# EAGLE design MAM_GND (EAGLE 9.4.2)
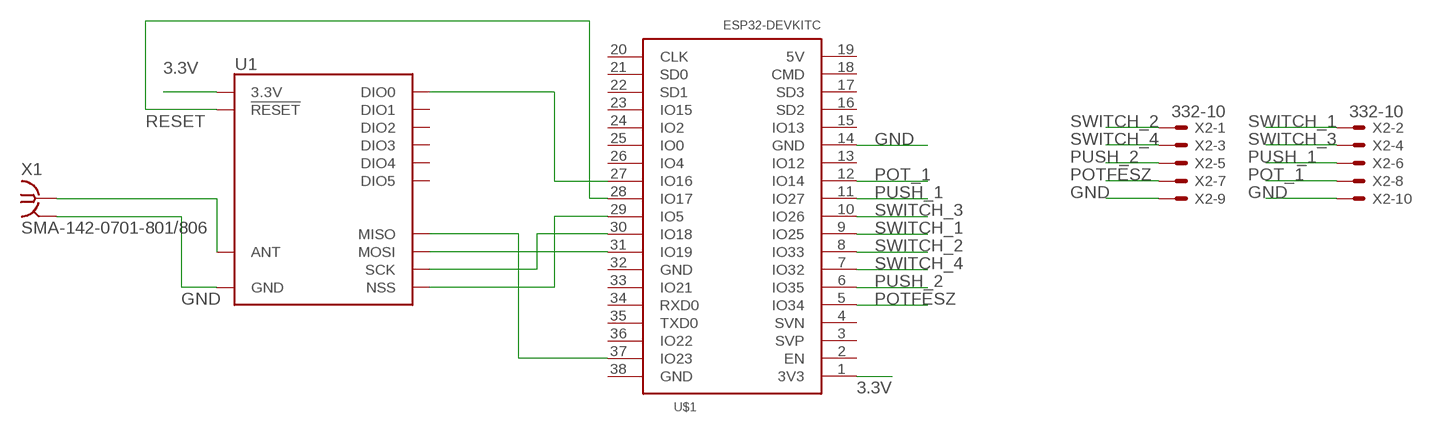
[diagram p0: schematic, sheet 1]

## Parts
U1  RFM95W  [RFM95/96/97/98W]
U$1  ESP32DEVKITC  [ESP32-DEVKITC]
X1  SMA-142-0701-801/806  [J502-ND-142-0701-801/806]
X2  332-10  [332-10]

## Nets
3.3V: U1.3.3V U$1.1(3V3)
GND: U1.GND@1(GND) U1.GND@2(GND) U1.GND@3(GND) U$1.14(GND) X1.G@1 X1.G@2 X1.G@3 X1.G@4 X2.9 X2.10
N$1: U1.MISO U$1.37(IO23)
N$2: U1.MOSI U$1.31(IO19)
N$3: U1.SCK U$1.30(IO18)
N$4: U1.NSS U$1.29(IO5)
N$5: U1.DIO0 U$1.27(IO16)
N$6: U1.ANT X1.1
POT_1: U$1.12(IO14) X2.8
POTFESZ: U$1.5(IO34) X2.7
PUSH_1: U$1.11(IO27) X2.6
PUSH_2: U$1.6(IO35) X2.5
RESET: U1.!RESET U$1.28(IO17)
SWITCH_1: U$1.9(IO25) X2.2
SWITCH_2: U$1.8(IO33) X2.1
SWITCH_3: U$1.10(IO26) X2.4
SWITCH_4: U$1.7(IO32) X2.3
Unconnected: U1.DIO1 U1.DIO2 U1.DIO3 U1.DIO4 U1.DIO5 U$1.2(EN) U$1.3(SVP) U$1.4(SVN) U$1.13(IO12) U$1.15(IO13) U$1.16(SD2) U$1.17(SD3) U$1.18(CMD) U$1.19(5V) U$1.20(CLK) U$1.21(SD0) U$1.22(SD1) U$1.23(IO15) U$1.24(IO2) U$1.25(IO0) U$1.26(IO4) U$1.32(GND) U$1.33(IO21) U$1.34(RXD0) U$1.35(TXD0) U$1.36(IO22) U$1.38(GND)

## Library data of the parts
U1 = SparkFun-RF:RFM95W: RFM95/96/97/98 The RFM95/96/97/98(W) transceivers feature the LoRaTM long range modem that provides ultra-long range spread spectrum communication and high interference immunity whilst minimising current consumption. These devices also support high performance (G)FSK modes for systems including WMBus, IEEE802.15.4g. The RFM95/96/97/98(W) deliver exceptional phase noise, selectivity, receiver linearity and IIP3 for significantly lower current consumption than competing devices Datasheet <http://www.hoperf.com/upload/rf/RFM95_96_97_98W.pdf>; PROD_ID: IC-13959
U$1 = ESP32-DEVKITC:ESP32DEVKITC
X1 = con-coax:SMA-: SMA 50 Ohm End Launch Jack Receptacle - Round Contact Johnson Components Source: www.johnsoncomponents.com .. J502-ND.pdf; MF: JOHNSON COMPONENTS; MPN: 142-0701-801; OC_FARNELL: 1608592; OC_NEWARK: 90F2624
X2 = con-garry:332-10: 10 Pin - 2mm Dual Row Source: www.mpe-connector.de / garry_shortform_2012.pdf

## Board
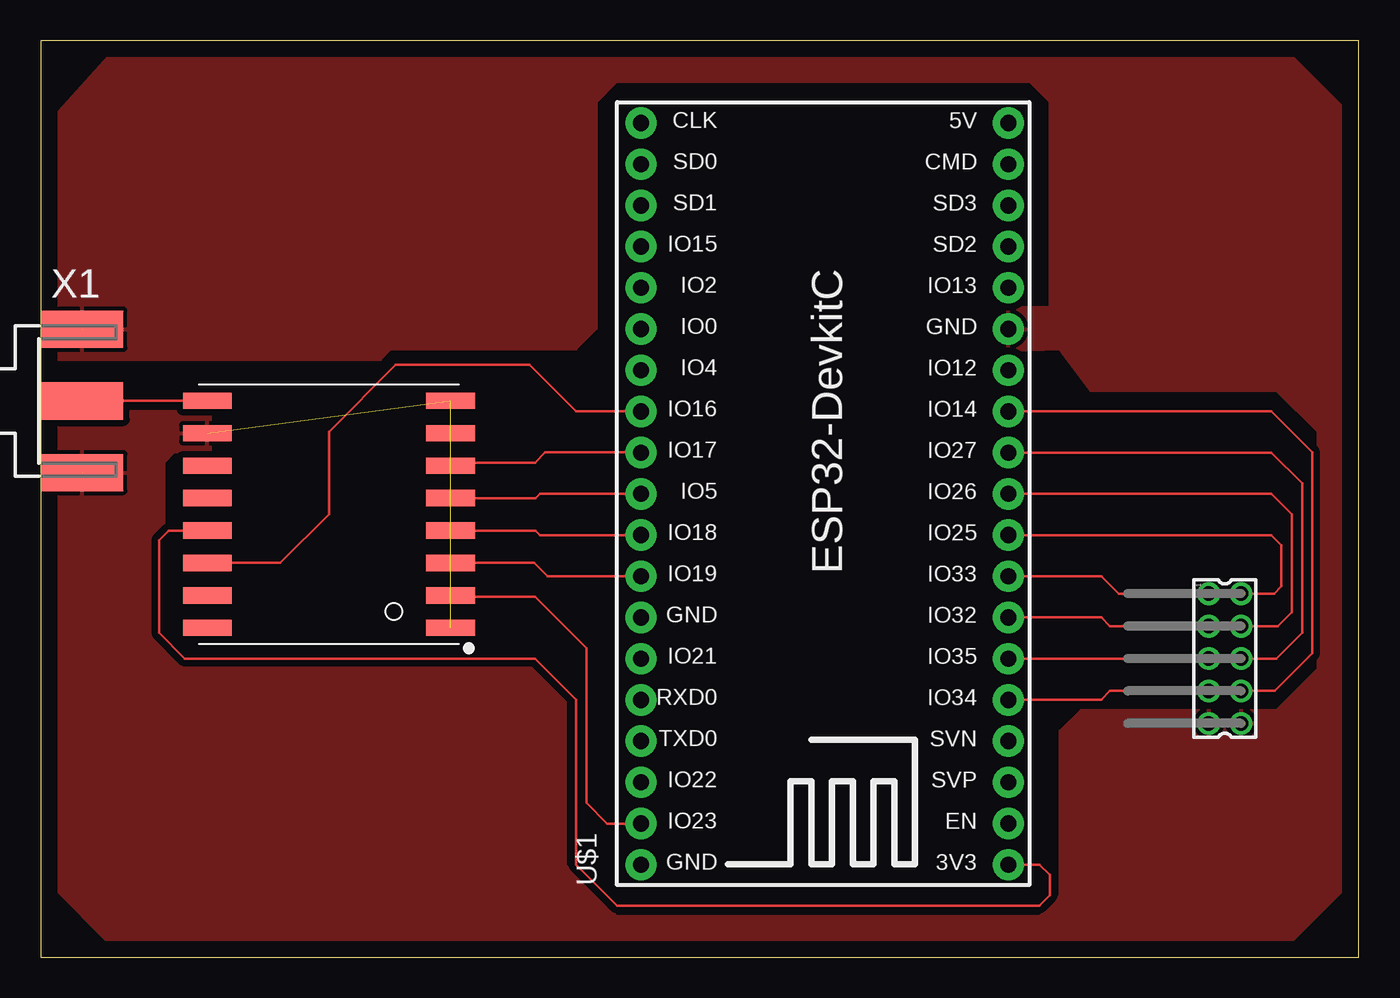
[diagram p1: board, top side]
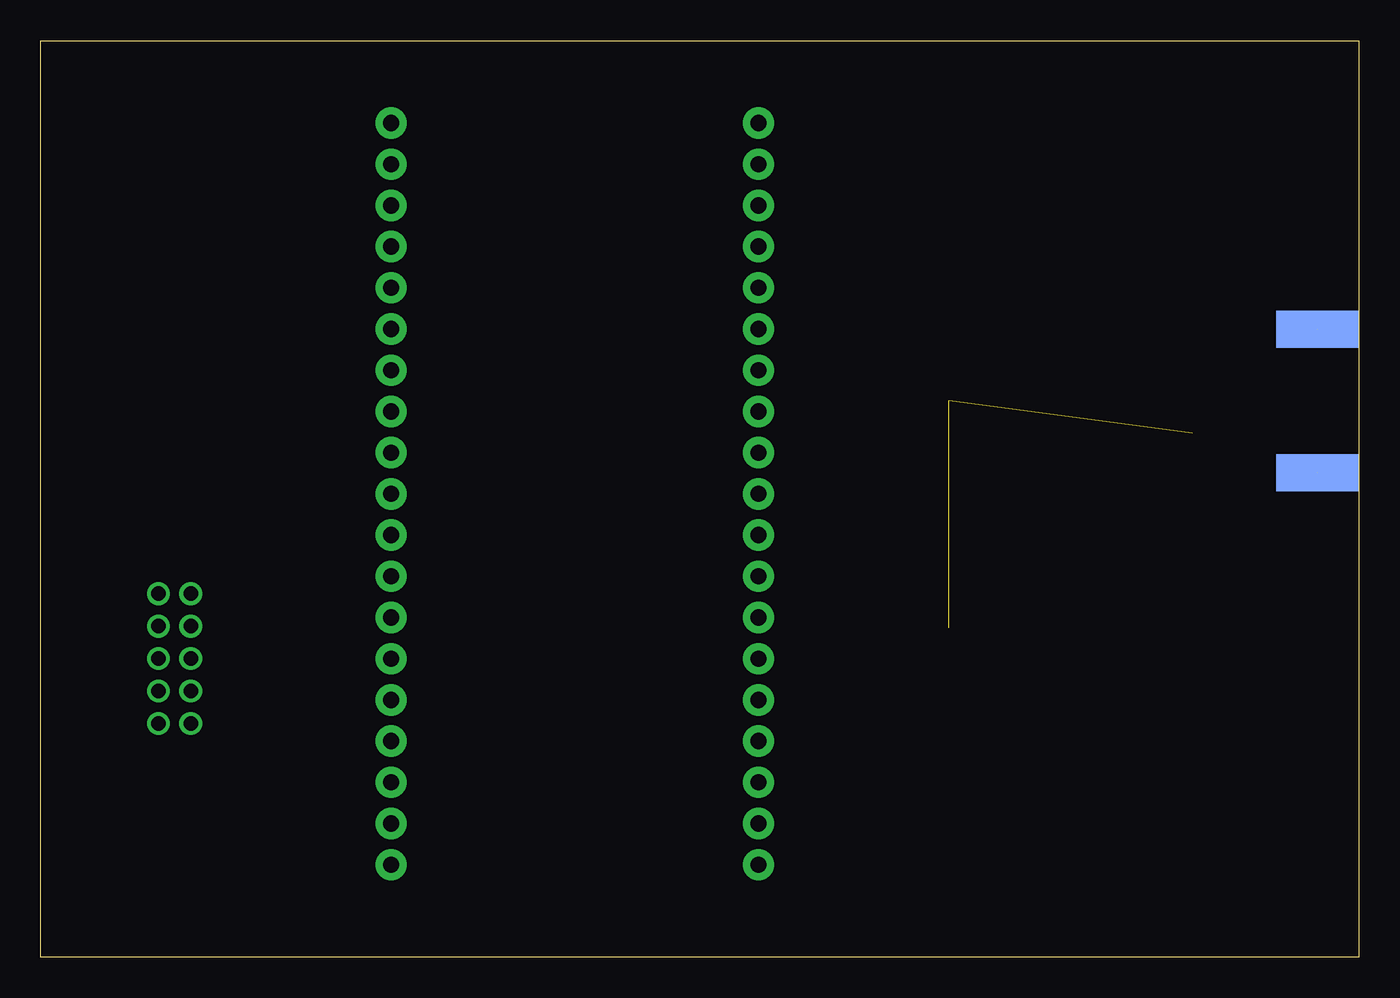
[diagram p2: board, bottom side, seen from below]

Size 81.29 x 56.51 mm. Coordinates in mm from the lower left corner, seen from the top.
Outline: 0,0 81.29,0 81.27,56.51 0,56.51 0,0
Copper layers (1*16): Top 0.035mm / dielectric 1.5mm / Bottom 0.035mm
Design rules "default": minimum track width 6mil, minimum drill 0.35mm, track to track 6mil, track to pad 6mil, pad to pad 6mil, via to via 6mil, smd to smd 6mil, copper to edge 40mil, drill to drill 6mil, minimum pad ring 10mil, minimum via ring 8mil, stop-mask expansion 4mil, vias tented up to drill 0mil, thermal gap 10mil

### Footprints (pad centres in the part's own frame; a part is rotated, then mirrored left to right if it is on the bottom)
RFM95/96/97/98W = smd 3 x 1: 3.3V 7.5,1; !RESET -7.5,-3; ANT 7.5,-7; DIO0 7.5,3; DIO1 7.5,5; DIO2 7.5,7; DIO3 7.5,-3; DIO4 7.5,-1; DIO5 -7.5,-5; GND@1 -7.5,7; GND@2 -7.5,-7; GND@3 7.5,-5; MISO -7.5,5; MOSI -7.5,3; NSS -7.5,-1; SCK -7.5,1
ESP32-DEVKITC = drill 1 pad 1.93: 1 -22.87,-11.42; 2 -20.33,-11.42; 3 -17.79,-11.42; 4 -15.25,-11.42; 5 -12.71,-11.42; 6 -10.17,-11.42; 7 -7.63,-11.42; 8 -5.09,-11.42; 9 -2.55,-11.42; 10 -0.01,-11.42; 11 2.53,-11.42; 12 5.07,-11.42; 13 7.61,-11.42; 14 10.15,-11.42; 15 12.69,-11.42; 16 15.23,-11.42; 17 17.77,-11.42; 18 20.31,-11.42; 19 22.85,-11.42; 20 22.85,11.23; 21 20.31,11.23; 22 17.77,11.23; 23 15.23,11.23; 24 12.69,11.23; 25 10.15,11.23; 26 7.61,11.23; 27 5.07,11.23; 28 2.53,11.23; 29 -0.01,11.23; 30 -2.55,11.23; 31 -5.09,11.23; 32 -7.63,11.23; 33 -10.17,11.23; 34 -12.71,11.23; 35 -15.25,11.23; 36 -17.79,11.23; 37 -20.33,11.23; 38 -22.87,11.23
J502-ND-142-0701-801/806 = smd 5.08 x 2.286: 1 2.565,0; G@1 2.565,4.42; G@2 2.565,-4.42 | smd 5.08 x 2.286 bottom: G@3 2.565,4.42; G@4 2.565,-4.42
332-10 = drill 0.9 pad 1.27: 1 -4,-1; 2 -4,1; 3 -2,-1; 4 -2,1; 5 0,-1; 6 0,1; 7 2,-1; 8 2,1; 9 4,-1; 10 4,1

### Placement (x,y rotation side)
U1  17.78,27.3 180 top
U$1  48.26,28.57 90 top
X1  0,34.29 0 top
X2  73.03,18.41 270 top

### Tracks (layer width: path | path; a pad name or v marks a point on that pad's centre or on a via)
3.3V
  Top 0.152: U1.3.3V 7.89,26.3 7.3,25.72 7.3,20 8.89,18.41 30.48,18.41 33.02,15.88 33.02,5.71 35.56,3.17 61.59,3.17 62.23,3.81 62.23,5.08 61.59,5.71 59.69,5.71 U$1.1
GND  (4 unrouted)
  pour Top (isolate 0.406): 0,5.08 0,33.02 0.64,33.66 10.48,33.66 10.48,31.11 8.26,31.11 7.62,30.48 7.62,20.32 8.89,19.05 30.48,19.05 32.38,17.14 32.38,5.71 35.56,2.54 61.59,2.54 62.87,3.81 62.87,13.97 64.14,15.24 76.2,15.24 78.74,17.78 78.74,32.38 76.2,34.93 64.77,34.93 62.87,37.47 58.99,37.35 58.99,40.07 62.23,40.07 62.23,52.71 60.96,53.98 35.56,53.98 34.29,52.71 34.29,38.74 33.02,37.47 21.59,37.47 20.95,36.83 0,36.83 -0.03,50.89 5.08,56.52 76.2,56.52 81.28,51.44 81.28,5.08 76.2,0 5.08,0
N$1
  Top 0.152: U1.MISO 25.36,22.22 30.48,22.22 33.66,19.05 33.66,9.53 34.94,8.24 U$1.37
N$2
  Top 0.152: U1.MOSI 30.43,24.3 31.25,23.48 U$1.31
N$3
  Top 0.152: U1.SCK 30.53,26.3 30.81,26.02 U$1.30
N$4
  Top 0.152: U$1.29 37.02,28.57 30.8,28.57 30.53,28.3 U1.NSS
N$5
  Top 0.152: 10.6,24.62 U1.DIO0 14.78,24.3 17.78,27.3 17.78,32.38 21.91,36.51 30.16,36.51 33.03,33.65 U$1.27
N$6
  Top 0.152: X1.1 10.27,34.29 U1.ANT
POT_1
  Top 0.152: U$1.12 75.89,33.65 78.42,31.11 78.42,18.73 76.11,16.41 X2.8
POTFESZ
  Top 0.152: U$1.5 65.39,15.87 65.94,16.41 X2.7
PUSH_1
  Top 0.152: U$1.11 75.89,31.11 77.79,29.21 77.79,20 76.2,18.41 X2.6
PUSH_2
  Top 0.152: U$1.6 72.02,18.41 X2.5
RESET
  Top 0.152: U$1.28 31.11,31.11 30.48,30.48 25.45,30.48 U1.!RESET
SWITCH_1
  Top 0.152: X2.2 76.07,22.41 76.52,22.86 76.52,25.4 75.89,26.02 U$1.9
SWITCH_2
  Top 0.152: U$1.8 65.42,23.48 66.48,22.41 X2.1
SWITCH_3
  Top 0.152: X2.4 76.3,20.41 77.15,21.27 77.15,27.3 75.88,28.57 59.69,28.57 U$1.10
SWITCH_4
  Top 0.152: U$1.7 65.42,20.95 65.94,20.41 X2.3